# Altium schematic sheet schematic.SchDoc
size A
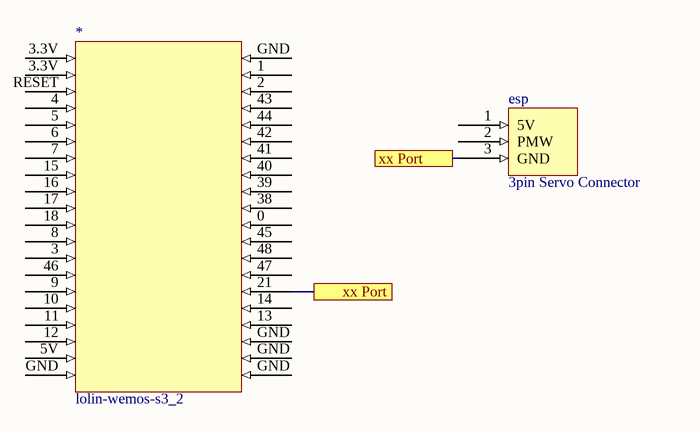
[diagram p0: schematic.SchDoc]

## Parts
*  lolin-wemos-s3_2  [lolin-wemos-s3 -Footprint-2]
esp  3pin Servo Connector  [3pin Servo Connector-Footprint-1]

## Ports
xx Port

## Nets
xx Port: *.21 esp.3(GND) ; port xx Port

Not connected (* = marked no-connect by the designer): * 0 1 2 3 3.3V 4 5 5V 6 7 8 9 10 11 12 13 14 15 16 17 18 38 39 40 41 42 43 44 45 46 47 48 GND RESET; esp 1(5V) 2(PMW)

## Library data of the parts
* = CMP-002-00071-2: esp32 s3 developer board
esp = CMP-002-00072-1: 3 -pin header for simple servo